# Altium schematic sheet FanPWM.SchDoc
size Letter
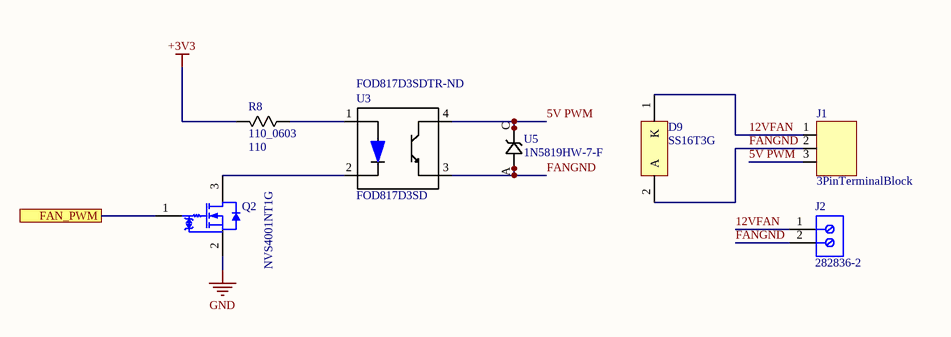
[diagram p0: FanPWM.SchDoc]

## Parts
D9  SS16T3G  [ONSC-SMA-2-403D-02_V]
J1  3PinTerminalBlock  [3 POS 5mm Pitch]
J2  282836-2  [TECO-282836-2_V]
Q2  NVS4001NT1G  [ONSC-SC-70-3-419-04_V]
R8  110_0603  Resistance: 110  [0603]
U3  FOD817D3SD  Supplier Part Number 1: FOD817D3SDTR-ND  [FOD817D3SD]
U5  1N5819HW-7-F  [1N5819HW-7-F]

## Ports
FAN_PWM

## Nets
+3V3: R8.1
GND: Q2.2(S)
5V PWM: J1.3 U3.4(COLLECTOR) U5.C
12VFAN: D9.1(K) J1.1 J2.1
FAN_PWM: Q2.1(G) ; port FAN_PWM
FANGND: D9.2(A) J1.2 J2.2 U3.3(EMITER) U5.A
NetQ2_3: Q2.3(D) U3.2(CATHODE)
NetR8_2: R8.2 U3.1(ANODE)

## Library data of the parts
D9 = SS16T3G: Schottky Power Rectifier, 2-Pin SMA, Pb-Free, Tape and Reel; Manufacturer: On Semiconductor; Configuration: Single; IFSM Max (A): 40; DatasheetVersion: Rev. 7; PackageVersion: Rev. G, 07/2012; PackageReference: SMA-2-403D-02; PackageDescription: 2-Pin Small Molded Package, J-Bend Lead, Body 2.605 x 4.315 mm; Supplier 1: Digi-Key; Supplier Part Number 1: SS16T3GOSTR-ND; Supplier 2: Digi-Key; Supplier Part Number 2: SS16T3GOSCT-ND; Supplier 3: Digi-Key; Supplier Part Number 3: SS16T3GOSDKR-ND; Supplier 4: Farnell; Supplier Part Number 4: 2317421; Supplier 5: Farnell; Supplier Part Number 5: 1900107; Supplier 6: Newark; Supplier Part Number 6: 98H0976; Supplier 7: Newark; Supplier Part Number 7: 10N9613; Supplier 8: Mouser; Supplier Part Number 8: 863-SS16T3G; Packing: Tape and Reel; RoHS: TRUE; Mounting Technology: Surface Mount; PartNumber: SS16T3G; ComponentLink1Description: Manufacturer URL; ComponentLink1URL: http://www.onsemi.com/; ComponentLink2Description: Datasheet; ComponentLink2URL: http://www.onsemi.cn/pub_link/Collateral/SS16-D.PDF; ComponentLink3Description: Package Specification; ComponentLink3URL: http://www.onsemi.com/pub_link/Collateral/403D-02.PDF
J1 = 3PinTerminalBlock: 3 Position terminal block
J2 = 282836-2: Female Header, Pitch 5 mm, 1 x 2 Position, Height 10 mm, Tail Length 3.5 mm, Rohs, Bulk; Current: 13.5A; Clamp Material - Plating: Brass - Nickel Plated; Dynamic Catalog: Buchanan Series; Positions Per Level: 2; Wire Termination: Screw - Rising Cage Clamp; Other Names: 5ULV-02B / A98076; Screw Thread: M3; Number of Levels: 1; Wire Gauge: 16-30 AWG; Product Training Modules: Wire-to-Board Eurostyle Terminal Blocks; Mating Orientation: Horizontal with Board; 3D Model: 282836-2.pdf; Featured Product: Eurostyle Terminal Block Connectors; Pitch: 0.197" (5.00mm); Voltage: 300V; Torque - Screw: 0.68 Nm (6 Lb-In); PackageReference: THD; PackageDescription: Female Header, Pitch 5 mm, 1 x 2 Position, Height 10 mm, Tail Length 3.5 mm; Supplier 1: Newark; Supplier Part Number 1: 23C9697; Supplier 2: Farnell; Supplier Part Number 2: 3089034; Supplier 3: Digi-Key; Supplier Part Number 3: A98076-ND; Features: Interlocking (Side); Color: Green; Packaging: Bulk; Family: Terminal Blocks - Wire to Board; Housing Material: Polyamide (PA66), Nylon 6/6; RoHS Information: 282836-2 Statement of Compliance; Mounting Type: Through Hole; Series: Buchanan; Standard Package: 300; Contact Material - Plating: Brass - Tin Plated; Category: Connectors, Interconnects; Screw Material - Plating: Brass - Nickel Plated; ComponentLink1Description: Manufacturer URL; ComponentLink1URL: http://www.te.com; ComponentLink2Description: Datasheet; ComponentLink2URL: http://www.te.com.cn/commerce/DocumentDelivery/DDEController?Action=showdoc&DocId=Catalog+Section%7F1308389_EUROSTYLE_TERMINAL_BLOCKS%7F0607%7Fpdf%7FEnglish%7FENG_CS_1308389_EUROSTYLE_TERMINAL_BLOCKS_0607.pdf%7F282836-2
Q2 = NVS4001NT1G: Small Signal MOSFET, 30 V, 270 mA, N-Channel, 3-Pin SC70, Pb-Free, Tape and Reel; Manufacturer: On Semiconductor; Channel Polarity: N Channel; Ciss Typ (pF): 20; Configuration: Single; Coss Typ (pF): 19; Crss Typ (pF): 7.25; ID Max (A): 0.27; PD Max (W): 0.33; V(BR)DSS Min (V): 30; VGS(th) Max (V): 1.5; DatasheetVersion: Rev. 5; PackageVersion: Rev. N, 11/2008; PackageReference: SC-70-3-419-04; PackageDescription: 3-Pin Small Outline Transistor, Body 2 x 1.25 mm, Pitch 0.65 mm; Supplier 1: Newark; Supplier Part Number 1: 60W1862; Supplier 2: Mouser; Supplier Part Number 2: 863-NVS4001NT1G; Package Type: SC-70-3; Packing: Tape and Reel; RoHS: Pb-Free; VGS Max (V): 20; Mounting Technology: Surface Mount; PartNumber: NVS4001NT1G; ComponentLink1Description: Manufacturer URL; ComponentLink1URL: http://www.onsemi.com/; ComponentLink2Description: Datasheet; ComponentLink2URL: http://www.onsemi.cn/pub_link/Collateral/NTS4001N-D.PDF; ComponentLink3Description: Package Specification; ComponentLink3URL: http://www.onsemi.cn/pub_link/Collateral/419-04.PDF
R8 = 110_0603: Manufacturer: Vishay; Manufacturer Part Number: CRCW0603110RFKEA; Power Rating: 100mW; Tolerance: 1%; Voltage Rating: 75V; Temperature Coefficient: 100ppm/°C; Supplier 1: Digi-Key; Stock 1: 35000; Pricing 1: 5000=0.00497, 10000=0.00432, 25000=0.00405 (USD); Mount: Surface Mount; Case/Package: 0603; Number of Pins: 2; Weight: 7.1E-05oz; Case Code (Metric): 1608; Case Code (Imperial): 0603; Contact Plating: Tin; Min Operating Temperature: -55°C; Max Operating Temperature: 155°C; Composition: Thick Film; Packaging: Tape and Reel; Voltage Rating (DC): 75V; Package Quantity: 10; Number of Terminations: 2; Military Standard: Not; Max Power Dissipation: 100mW; Termination: SMD/SMT; Length: 1.55mm; Height: 0.45mm; Width: 0.033inch; Depth: 0.85mm; Radiation Hardening: No; REACH SVHC: Unknown; Lead Free: Lead Free; ComponentLink1URL: https://datasheet.ciiva.com/11809/0900766b80d98afc-11809778.pdf; ComponentLink1Description: https://datasheet.ciiva.com/11809/0900766b80d98afc-11809778.pdf; ComponentLink2URL: https://datasheet.ciiva.com/2525/dcrcwe3-2525299.pdf; ComponentLink2Description: https://datasheet.ciiva.com/2525/dcrcwe3-2525299.pdf; ComponentLink3URL: https://datasheet.ciiva.com/2525/dcrcwe3-2525300.pdf; ComponentLink3Description: https://datasheet.ciiva.com/2525/dcrcwe3-2525300.pdf; ComponentLink4URL: https://datasheet.ciiva.com/2525/dcrcwe3-2525301.pdf; ComponentLink4Description: https://datasheet.ciiva.com/2525/dcrcwe3-2525301.pdf; ComponentLink5URL: https://datasheet.ciiva.com/7822/1697337-7822981.pdf; ComponentLink5Description: https://datasheet.ciiva.com/7822/1697337-7822981.pdf; ComponentLink6URL: https://datasheet.ciiva.com/16758/70201119-16758821.pdf; ComponentLink6Description: https://datasheet.ciiva.com/16758/70201119-16758821.pdf; ComponentLink7URL: https://datasheet.ciiva.com/3256/dcrcwe3-3256966.pdf; ComponentLink7Description: https://datasheet.ciiva.com/3256/dcrcwe3-3256966.pdf; ComponentLink8URL: https://datasheet.ciiva.com/7822/1697337-7822982.pdf; ComponentLink8Description: https://datasheet.ciiva.com/7822/1697337-7822982.pdf; ComponentLink9URL: https://datasheet.ciiva.com/3256/dcrcwe3-3256967.pdf; ComponentLink9Description: https://datasheet.ciiva.com/3256/dcrcwe3-3256967.pdf; ComponentLink10URL: https://datasheet.ciiva.com/26316/fld-crcw-e3-data-en-26316567.pdf; ComponentLink10Description: https://datasheet.ciiva.com/26316/fld-crcw-e3-data-en-26316567.pdf; ComponentLink11URL: https://datasheet.ciiva.com/16787/70201119-16787496.pdf; ComponentLink11Description: https://datasheet.ciiva.com/16787/70201119-16787496.pdf; ComponentLink12URL: https://datasheet.ciiva.com/7792/125364-7792010.pdf; ComponentLink12Description: https://datasheet.ciiva.com/7792/125364-7792010.pdf; ComponentLink13URL: https://datasheet.ciiva.com/16885/dcrcwe3-16885194.pdf; ComponentLink13Description: https://datasheet.ciiva.com/16885/dcrcwe3-16885194.pdf; ComponentLink14URL: https://datasheet.ciiva.com/22674/1912744-22674701.pdf; ComponentLink14Description: https://datasheet.ciiva.com/22674/1912744-22674701.pdf; ComponentLink15URL: https://datasheet.ciiva.com/22707/1697337-22707342.pdf; ComponentLink15Description: https://datasheet.ciiva.com/22707/1697337-22707342.pdf; Supplier Part Number 1: 541-110HTR-ND
U3 = FOD817D3SD: OPTOISOLATOR 5KV TRANSISTOR 4SMD 20mA/1.2V saturation; Manufacturer: ON Semiconductor / Fairchild; Max Power Dissipation: 200mW; Collector Emitter Voltage (VCEO): 200mV; Max Input Current: 50mA; Rise Time: 18000ns; Number of Channels: 1; Forward Voltage: 1.4V; Reverse Breakdown Voltage: 6V; Output Voltage: 70V; Current Transfer Ratio: 600%; Supplier 1: Digi-Key; Manufacturer Part Number: FOD817D3SD; Stock 1: 123000; Pricing 1: 1000=0.15939, 2000=0.14611, 5000=0.13283, 10000=0.12397, 25000=0.11954, 50000=0.11512 (USD); Mount: Surface Mount; Case/Package: SMD/SMT; Number of Pins: 4; Weight: 0g; Min Operating Temperature: -55°C; Max Operating Temperature: 110°C; Collector Emitter Saturation Voltage: 200mV; Package Quantity: 1; Packaging: Tape and Reel; Forward Current: 50mA; Max Output Voltage: 70V; Output Current per Channel: 50mA; Max Collector Current: 50mA; Isolation Voltage: 5kV; Fall Time: 18000ns; Number of Elements: 1; Power Dissipation: 200mW; Input Current: 50mA; Number of Circuits: 1; Radiation Hardening: No; REACH SVHC: No SVHC; Lead Free: Lead Free; ComponentLink1URL: https://datasheet.ciiva.com/25620/0900766b810e24fa-25620565.pdf; ComponentLink1Description: https://datasheet.ciiva.com/25620/0900766b810e24fa-25620565.pdf; ComponentLink2URL: https://datasheet.ciiva.com/26122/fod817d-26122105.pdf; ComponentLink2Description: https://datasheet.ciiva.com/26122/fod817d-26122105.pdf; ComponentLink3URL: https://datasheet.ciiva.com/15118/getdatasheetpartid-67082-15118458.pdf; ComponentLink3Description: https://datasheet.ciiva.com/15118/getdatasheetpartid-67082-15118458.pdf; ComponentLink4URL: https://datasheet.ciiva.com/2086/fod817d-2086155.pdf; ComponentLink4Description: https://datasheet.ciiva.com/2086/fod817d-2086155.pdf; ComponentLink5URL: https://datasheet.ciiva.com/46433/1563587-46433595.pdf; ComponentLink5Description: https://datasheet.ciiva.com/46433/1563587-46433595.pdf; ComponentLink6URL: https://datasheet.ciiva.com/2086/fod817d-2086156.pdf; ComponentLink6Description: https://datasheet.ciiva.com/2086/fod817d-2086156.pdf; ComponentLink7URL: https://datasheet.ciiva.com/2086/fod817d-2086157.pdf; ComponentLink7Description: https://datasheet.ciiva.com/2086/fod817d-2086157.pdf; ComponentLink8URL: https://datasheet.ciiva.com/8095/fod817d-8095549.pdf; ComponentLink8Description: https://datasheet.ciiva.com/8095/fod817d-8095549.pdf; ComponentLink9URL: https://datasheet.ciiva.com/4701/fod817d-4701711.pdf; ComponentLink9Description: https://datasheet.ciiva.com/4701/fod817d-4701711.pdf; ComponentLink10URL: https://datasheet.ciiva.com/17001/fod817-17001647.pdf; ComponentLink10Description: https://datasheet.ciiva.com/17001/fod817-17001647.pdf
U5 = 1N5819HW-7-F: DIODE SCHOTTKY 40V 1A SOD123